# Altium schematic sheet Power.SchDoc
size A4; SheetNumber: 2; SheetTotal: 5
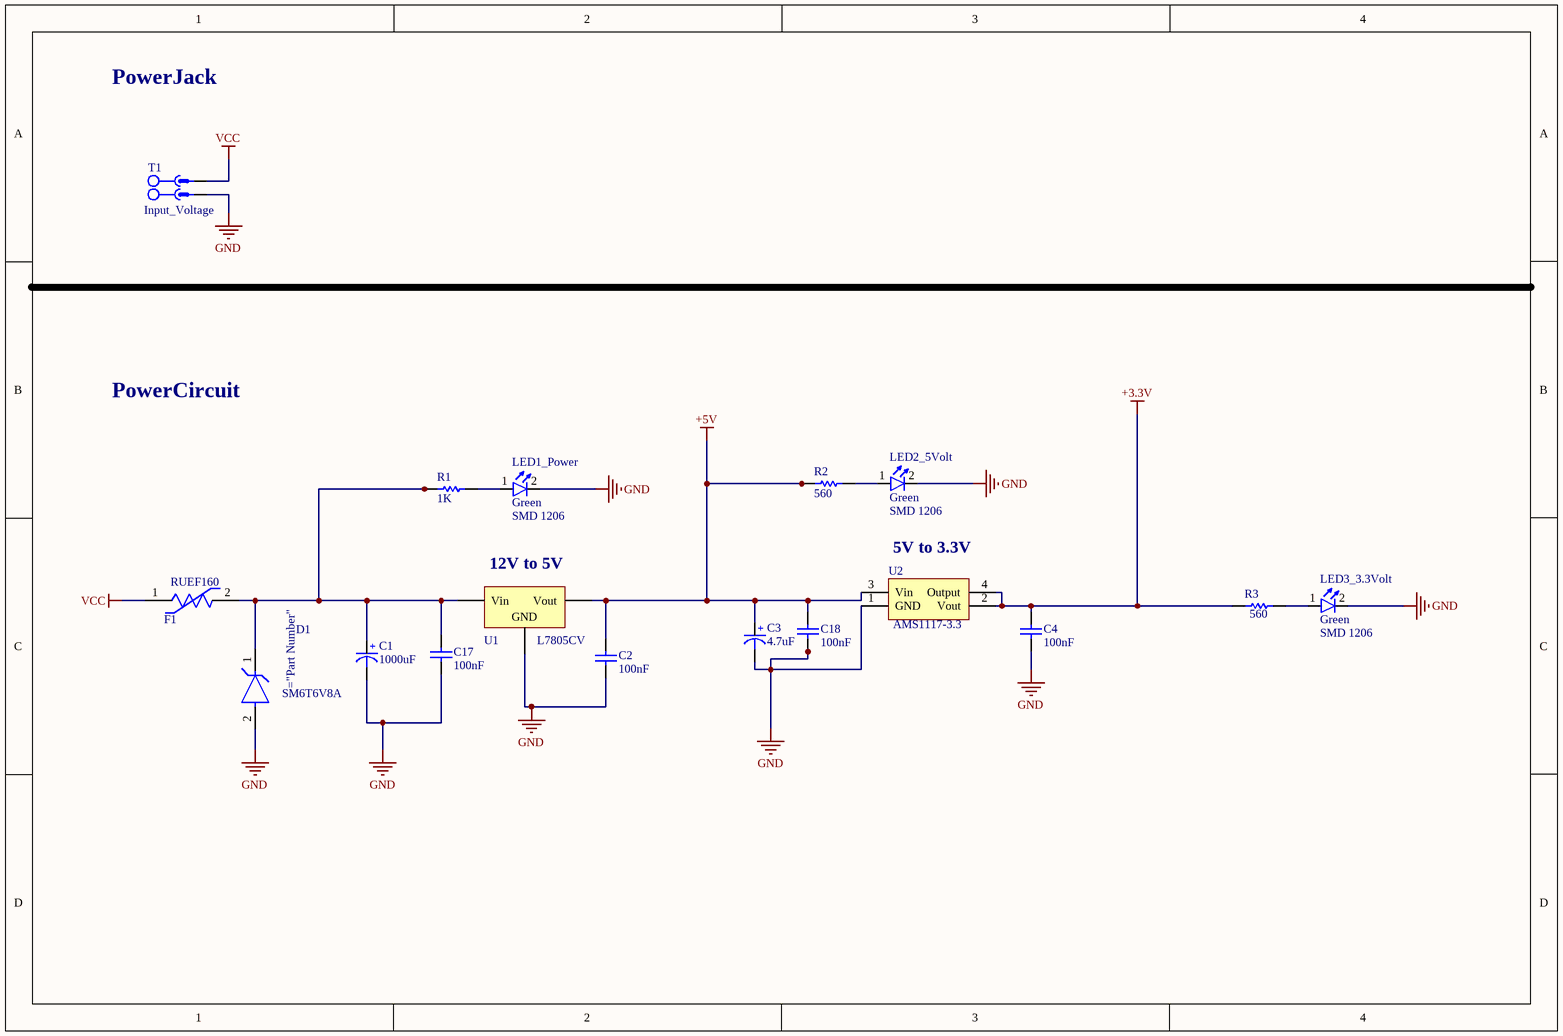
[diagram p0: Power.SchDoc]

## Parts
C1  1000uF  [cap 01]
C2  100nF  [CAPC3216L (1206)]
C3  4.7uF  [cap 01]
C4  100nF  [CAPC3216L (1206)]
C17  100nF  [CAPC3216L (1206)]
C18  100nF  [CAPC3216L (1206)]
D1  SM6T6V8A  [STMicroelectronics_SM6T6V8A_0]
F1  RUEF160  [Littelfuse_RUEF160]
LED1_Power  Size: SMD 1206  [LED SMD 1206]  (hidden comment: Green)
LED2_5Volt  Size: SMD 1206  [LED SMD 1206]  (hidden comment: Green)
LED3_3.3Volt  Size: SMD 1206  [LED SMD 1206]  (hidden comment: Green)
R1  1K  [RESC4817X04N]
R2  560  [RESC4817X04N]
R3  560  [RESC4817X04N]
T1  Input_Voltage  [MSTBV 2,5/2-G-5]
U1  L7805CV  [TO-220 AB]
U2  AMS1117-3.3  [SOT223-4N]

## Nets
+3.3V: C4.1(+) R3.1 U2.2(Vout) U2.4(Output)
+5V: C2.1(+) C3.1(+) C18.1(+) R2.1 U1.3(Vout) U2.3(Vin)
GND: C1.2(-) C2.2(-) C3.2(-) C4.2(-) C17.2(-) C18.2(-) D1.2(A) LED1_Power.2(K) LED2_5Volt.2(K) LED3_3.3Volt.2(K) T1.1 U1.2(GND) U2.1(GND)
VCC: F1.1 T1.2
NetC1_1: C1.1(+) C17.1(+) D1.1(K) F1.2 R1.1 U1.1(Vin)
NetLED1_Power_1: LED1_Power.1(A) R1.2
NetLED2_5Volt_1: LED2_5Volt.1(A) R2.2
NetLED3_3.3Volt_1: LED3_3.3Volt.1(A) R3.2

## Notes on the sheet
- PowerJack
- PowerCircuit
- (near U1) 12V to 5V
- 5V to 3.3V

## Library data of the parts
C1 C3 = CAP_Polar: Polar Capacitor; Designer: Eng. Saeid Jorablo; Company: SJ Libraries; Voltage: 16V; ComponentLink1Description: Datasheet; ComponentLink2Description: Reference; Publisher: SJ Unlimited; Mounting Technology: Surface Mount\Through-Hole; HelpURL: http://s3.picofile.com/file/7443264187/Coming_Soon_logo.gif; Status: Unreleased
  C1: Value: 1000uF
  C3: Value: 4.7uF
C2 C4 C17 C18 = CAP_Bipolar: Bipolar Capacitor; Voltage: 100V; Designer: Eng. Saeid Jorablo; Company: SJ Libraries; ComponentLink1Description: Datasheet; ComponentLink2Description: Reference; Publisher: SJ Unlimited; Mounting Technology: *; Mounting Technology: Surface Mount\Through-Hole; HelpURL: http://s3.picofile.com/file/7443264187/Coming_Soon_logo.gif; Status: Unreleased; Value: 100nF
D1 = SM6T6V8A: TVS DIODE 5.8VWM 13.4VC SMB
F1 = RUEF160: Littelfuse RUEF160----PTC Resettable Fuse 1.6A(hold) 3.2A(trip) 30V 100A 0.9W 8s 0.03Ohm Radial 8.9 X 3 X 15.2mm Bag
LED1_Power LED2_5Volt LED3_3.3Volt = LED: Designer: Saeid Jorablo; Organazation: ControTec; Adding Date: 1387/12/22; Color: Green
R1-R3 = RES 1206 0.25W: RES 1206; Designer: Abbas Basereh; Desc.: RES SMD 1206; Data: 16-12-2016
T1 = CON_Phoenix_MSTBV_02: 2 Pitch: 5 mm Color: green Contact surface: Tin Assembly; Manufacturer: PHOENIX CONTACT; PART.NO: 1753437; Connector type: PCB Terminal Block; designer: ABBAS BASEREH; Max Current: 12 A; Positions: 2; Voltage: 320 V; Category: Connector; ComponentLink1Description: Header, Nominal current: 12 A Rated voltage (III/2): 320 V Number of positions: 2 Pitch: 5 mm Color: green Contact surface: Tin Assembly: Soldering  DESIGNER:ABBAS BASEREH; ComponentLink2Description: Reference; Mounting Technology: Through-Hole; Pin Count: 2; Revision 1: 2017-3-1; Status: Unreleased
U1 = L7805CV-Linear Voltage Regulator IC Positive 1 Output 5V 1.5A TO-220AB: Linear Voltage Regulator IC Positive FIXED; Manufacturer: STMicroelectronics; Designer: Abbas Basereh; Link: https://www.aliexpress.com/item/; Link: http://www.tme.eu/en/; Link: http://www.digikey.com/; Part. No: L7805CV
U2 = IC_AMS1117-3.3: 800mA LOW DROPOUT VOLTAGE REGULATOR; Manufacturer: Advanced Monolithic Systems, Inc.; Company: SJ Libraries; Designer: Eng. Saeid Jorablo; ESD Sensetive: True/False; Code_IPC: SOT-223; ComponentLink1Description: Datasheet; ComponentLink1URL: http://www.advanced-monolithic.com/pdf/ds1117.pdf; ComponentLink2Description: Reference; ComponentLink2URL: http://www.advanced-monolithic.com/index.html; PackageDescription: SOT223, 4-Leads, Body 6.7x7.3mm (max), Pitch 2.30mm; PinCount: 4; Update: 6/5/2012; Category: Integrated Circuit; Status: Unrelease; HelpURL: http://s3.picofile.com/file/7443264187/Coming_Soon_logo.gif; Operating Temperature: -55 ~ +125 (C); Mounting Technology: Surface Mount; RoHS compliant: True/False